# EasyEDA schematic easyeda.json
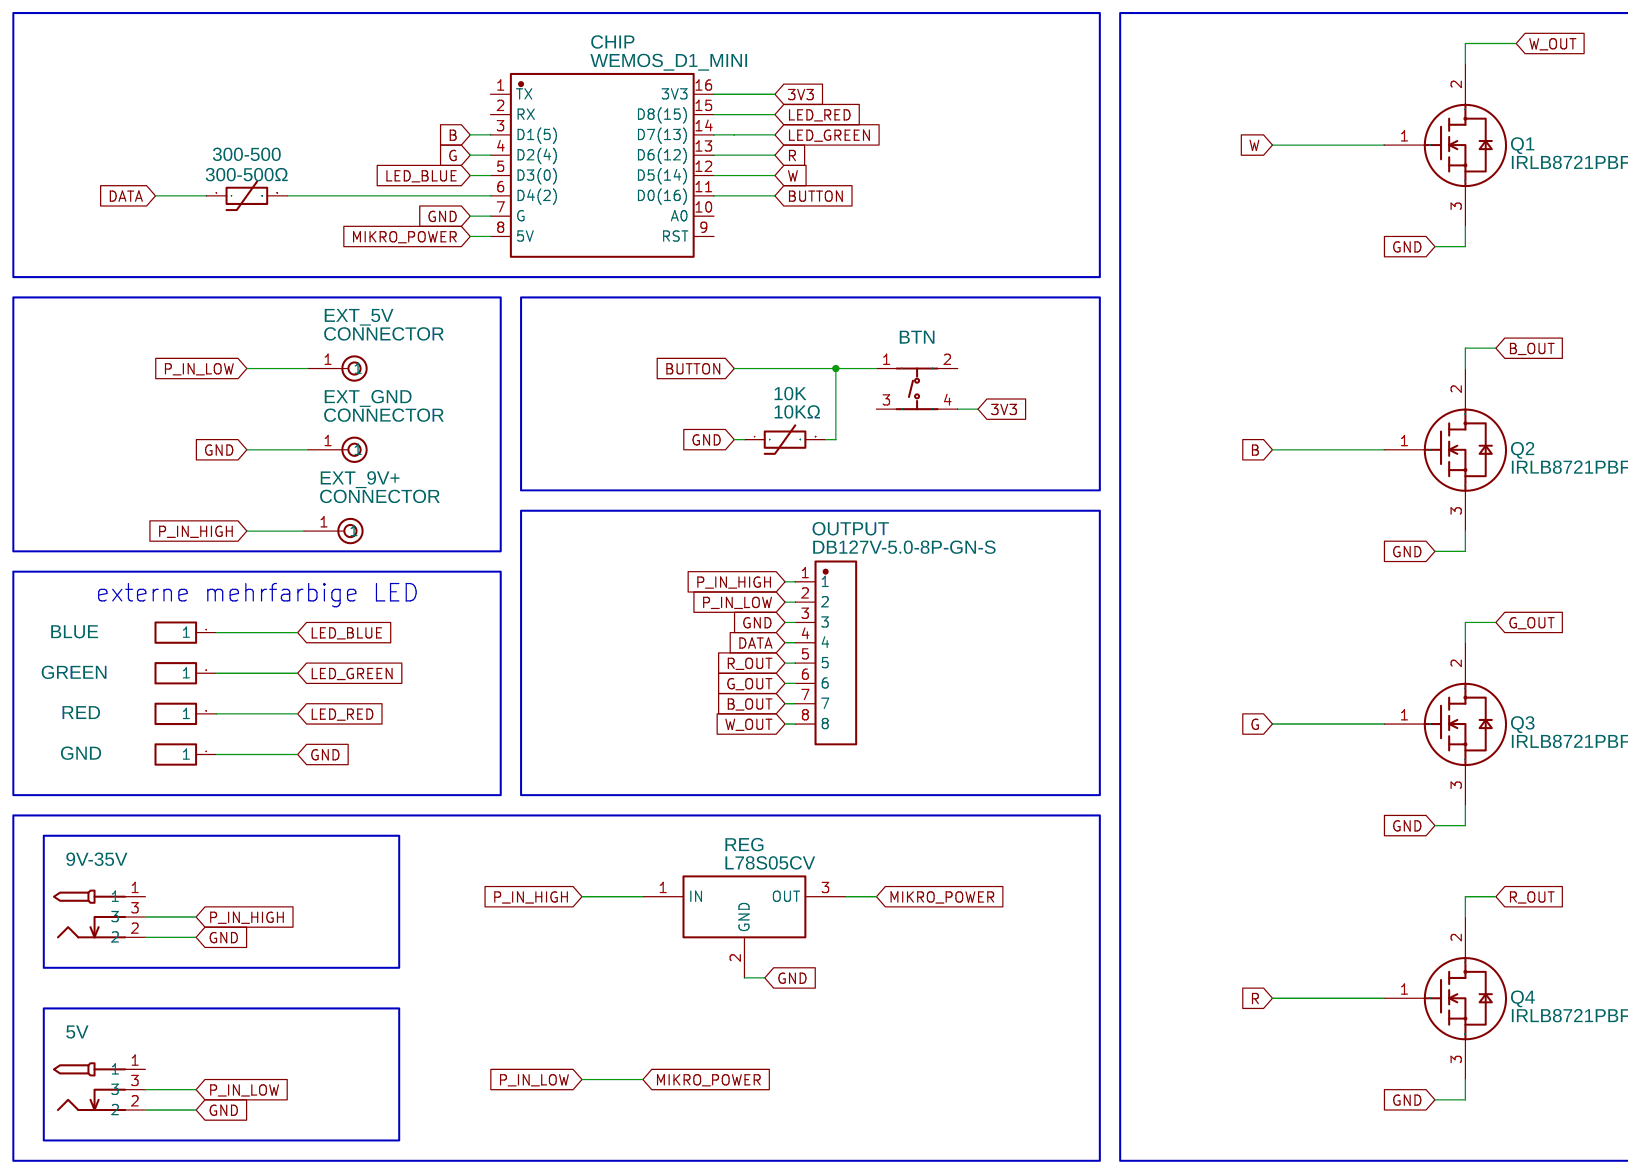
[diagram p0: schematic sheet]

## Parts
5V  IN  [DC-IN-TH_DC-5520]
9V-35V  IN  [DC-IN-TH_DC-5520]
10K  10KΩ  [RES-TH_BD2.5-L4.7-P8.70-D0.5]
300-500  300-500Ω  [RES-TH_BD2.5-L4.7-P8.70-D0.5]
BLUE  BUZZER-DATA  [HDR-M-2.54_1X1]
BTN  BTN  [KEY-TH_4P-L12.5-W10.0-P6.00]
CHIP  WEMOS_D1_MINI  [DIP-16_WEMOS_D1_MINI_PRO4]
EXT_5V  CONNECTOR  [HOLEHOLE]
EXT_9V+  CONNECTOR  [HOLEHOLE]
EXT_GND  CONNECTOR  [HOLEHOLE]
GND  BUZZER-DATA  [HDR-M-2.54_1X1]
GREEN  BUZZER-DATA  [HDR-M-2.54_1X1]
OUTPUT  DB127V-5.0-8P-GN-S  [CONN-TH_8P-P5.00_DB127V-5.0-8P-GN-S]
Q1  IRLB8721PBF  [TO-220-3_L10.0-W4.5-P2.54-L]
Q2  IRLB8721PBF  [TO-220-3_L10.0-W4.5-P2.54-L]
Q3  IRLB8721PBF  [TO-220-3_L10.0-W4.5-P2.54-L]
Q4  IRLB8721PBF  [TO-220-3_L10.0-W4.5-P2.54-L]
RED  BUZZER-DATA  [HDR-M-2.54_1X1]
REG  L78S05CV  [TO-220-3_L10.0-W4.5-P2.54-L]

## Library data of the parts
5V 9V-35V = DC-005 5.5-2.0MM: Supplier: LCSC; Manufacturer: BOOMELE; image: //image.lceda.cn/szlcsc/C16214.jpg; Supplier Part: C16214
10K 300-500 = 10KΩ ±1%_MF58: Supplier: LCSC; Supplier Part: C123393; Manufacturer: Nanjing Shiheng Elec; Manufacturer Part: MF58 103F3950; Contributor: LCSC; JLCPCB Part Class: Extended Part
BLUE GND GREEN RED = HDR-M-2.54_1x1: Supplier Part: C81276; Supplier: LCSC; Contributor: LCEDA_Lib
BTN = TSW101G232-250Z: Supplier: LCSC; Supplier Part: C326507; Manufacturer: BRIGHT; Contributor: LCSC; JLCPCB Part Class: Extended Part
CHIP = WEMOS_D1_MINI_PRO4: Supplier: LCSC; Supplier Part: C2837266; Manufacturer: null; Manufacturer Part: Wemos_D1_mini_Pro4; Contributor: LCSC; JLCPCB Part Class: Extended Part
EXT_5V EXT_9V+ EXT_GND = HOLE COPY: Contributor: Fishy
OUTPUT = DB127V-5.0-8P-GN-S: Supplier: LCSC; Supplier Part: C430626; Manufacturer: DIBO; Contributor: LCSC; JLCPCB Part Class: Extended Part
Q1-Q4 = IRLB8721PBF: Supplier: LCSC; Manufacturer: Infineon; Contributor: LCSC; Supplier Part: C153222; JLCPCB Part Class: Extended Part
REG = L78S05CV: Supplier: LCSC; Manufacturer: STMicroelectronics; Supplier Part: C33043; JLCPCB Part Class: Extended Part

## Nets
3V3: BTN.4 CHIP.16(3V3)
GND: 5V.2 9V-35V.2 10K.1 CHIP.7(G) EXT_GND.1 GND.1 OUTPUT.3 Q1.3(S) Q2.3(S) Q3.3(S) Q4.3(S) REG.2(GND)
B: CHIP.3(D1(5)) Q2.1(G)
B_OUT: OUTPUT.7 Q2.2(D)
BUTTON: 10K.2 BTN.1 CHIP.11(D0(16))
DATA: 300-500.1 OUTPUT.4
G: CHIP.4(D2(4)) Q3.1(G)
G_OUT: OUTPUT.6 Q3.2(D)
LED_BLUE: BLUE.1 CHIP.5(D3(0))
LED_GREEN: CHIP.14(D7(13)) GREEN.1
LED_RED: CHIP.15(D8(15)) RED.1
MIKRO_POWER: 5V.3 CHIP.8(5V) EXT_5V.1 OUTPUT.2 REG.3(OUT)
P_IN_HIGH: 9V-35V.3 EXT_9V+.1 OUTPUT.1 REG.1(IN)
R: CHIP.13(D6(12)) Q4.1(G)
R_OUT: OUTPUT.5 Q4.2(D)
W: CHIP.12(D5(14)) Q1.1(G)
W_OUT: OUTPUT.8 Q1.2(D)
Net-(300-500-2): 300-500.2 CHIP.6(D4(2))

Not connected (* = marked no-connect by the designer): 5V 1; 9V-35V 1; BTN 2 3; CHIP 1(TX) 2(RX) 9(RST) 10(A0)

## Notes on the sheet
- externe mehrfarbige LED
